# EAGLE design SWD-IR-SMD-V01-001 (EAGLE 7.6.0)
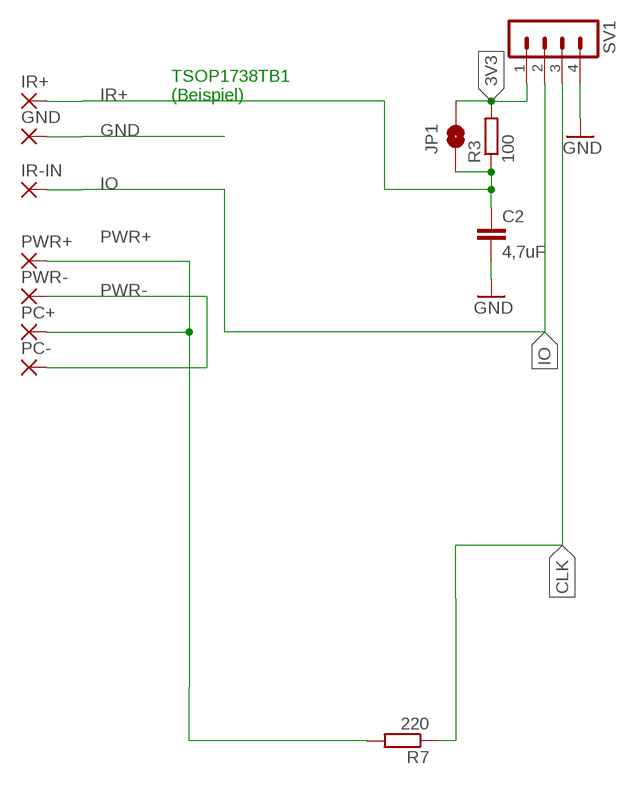
[diagram p0: schematic, sheet 1]

## Parts
C2  4,7uF  C-EUC1206K  [C1206K]
GND  SMD2  [SMD1,27-2,54]
IR+  SMD2  [SMD1,27-2,54]
IR-IN  SMD2  [SMD1,27-2,54]
JP1  JUMPER-SMT_2_NO_NO-SILK  [SMT-JUMPER_2_NO_NO-SILK]
PC+  SMD2  [SMD1,27-2,54]
PC-  SMD2  [SMD1,27-2,54]
PWR+  SMD2  [SMD1,27-2,54]
PWR-  SMD2  [SMD1,27-2,54]
R3  100  R-EU_R0805W  [R0805W]
R7  220  R-EU_R0805W  [R0805W]
SV1  MA04-1  [MA04-1]

## Nets
3V3: JP1.2 R3.2 SV1.1
CLK: R7.1 SV1.3
GND [Power]: C2.2 GND.1(P) SV1.4
IO: IR-IN.1(P) SV1.2
IR+: C2.1 IR+.1(P) JP1.1 R3.1
PWR+: PC+.1(P) PWR+.1(P) R7.2
PWR-: PC-.1(P) PWR-.1(P)

## Notes on the sheet
- TSOP1738TB1
  (Beispiel)

## Library data of the parts
C2 = rcl:C-EU: CAPACITOR, European symbol
GND IR+ IR-IN PC+ PC- PWR+ PWR- = wirepad:SMD2: SMD PAD
JP1 = SparkFun-Jumpers:JUMPER-SMT_2_NO: Normally open jumper This jumper has two pads in close proximity to each other. Apply solder to close the connection. Round pads are easier to solder for beginners, but are a lot larger. SparkFun Product that uses the round pads: SparkFun EL Sequencer <https://www.sparkfun.com/products/12781>
R3 R7 = rcl:R-EU_: RESISTOR, European symbol
SV1 = con-lstb:MA04-1: PIN HEADER; OC_FARNELL: unknown; OC_NEWARK: unknown

## Net classes
0 default: width 0.305 mm
1 Power: width 0.406 mm

## Board
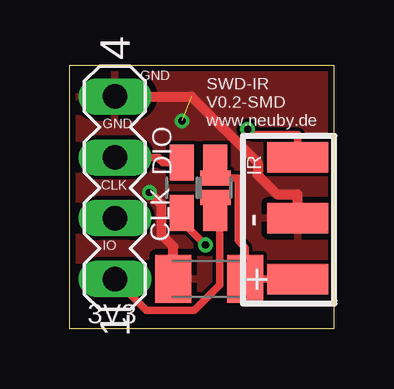
[diagram p1: board, top side]
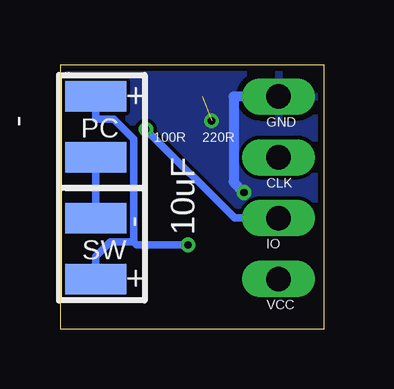
[diagram p2: board, bottom side, seen from below]

Size 11 x 11 mm. Coordinates in mm from the lower left corner, seen from the top.
Outline: 0,11 11,11 11,0 0,0 0,11
Copper layers (1*16): Top 0.035mm / dielectric 1.5mm / Bottom 0.035mm
Design rules "Fusion_eagle_rule_v1.1": minimum track width 6mil, minimum drill 12mil, track to track 6mil, track to pad 6mil, pad to pad 6mil, via to via 6mil, smd to smd 0mil, copper to edge 10mil, drill to drill 10mil, minimum pad ring 10mil, minimum via ring 6mil, stop-mask expansion 2mil, vias tented up to drill 100mil, thermal gap 10mil

### Footprints (pad centres in the part's own frame; a part is rotated, then mirrored left to right if it is on the bottom)
C1206K = smd 1.5 x 2: 1 -1.5,0; 2 1.5,0
SMD1,27-2,54 = smd 1.27 x 2.54: 1 0,0
SMT-JUMPER_2_NO_NO-SILK = smd 0.635 x 1.27: 1 -0.406,0; 2 0.406,0
R0805W = smd 1.5 x 1: 1 -1.052,0; 2 1.052,0
MA04-1 = drill 1.016 long: 1 -3.81,0; 2 -1.27,0; 3 1.27,0; 4 3.81,0

### Placement (x,y rotation side)
C2  5.83,2.08 180 top
GND  9.51,4.62 90 top
IR+  9.51,2.08 90 top
IR-IN  9.51,7.16 90 top
JP1  6.08,5.89 270 top
PC+  9.51,9.7 90 bottom
PC-  9.51,7.16 90 bottom
PWR+  9.51,2.08 90 bottom
PWR-  9.51,4.62 90 bottom
R3  6.08,5.89 270 top
R7  4.68,5.89 270 top
SV1  1.89,5.89 90 top

### Tracks (layer width: path | path; a pad name or v marks a point on that pad's centre or on a via)
3V3
  Top 0.305: SV1.1 3.2,0.77 5.2,0.77 6.27,1.84 6.27,4.65 R3.2 JP1.2
CLK
  Top 0.305: SV1.3 3.72,7.16 3.72,7.1 3.88,6.94 R7.1
GND  (via drill 0.3 pad 0.61)  (1 unrouted)
  Top 0.406: GND.1 9.51,5.61 8.65,5.61 7.84,6.43 7.84,6.94 5.08,9.7 SV1.4 | C2.2 4.33,3.44 3.83,3.93 3.83,5.2 v3.33,5.7
  Bottom 0.406: SV1.4 3.77,9.7 3.77,6.13 v3.33,5.7
  other vias: 4.68,8.68
  pour Top: 0.37,10.72 10.78,10.72 10.78,0.3 0.37,0.3
  pour Bottom: 0.37,10.72 10.78,10.72 10.78,0.3 0.37,0.3
IO  (via drill 0.3 pad 0.61)
  Top 0.305: v7.42,8.32 7.65,8.1 9.51,8.1 IR-IN.1
  Bottom 0.305: v7.42,8.32 3.72,4.62 SV1.2
IR+
  Top 0.305: IR+.1 7.94,2.08 7.94,2.12 7.33,2.73 | 7.33,2.73 7.33,3.38 7.02,3.69 7.02,6.3 JP1.1 R3.1 | C2.1 7.33,2.73
PWR+  (via drill 0.3 pad 0.61)
  Top 0.305: R7.2 4.68,4.48 v5.66,3.5
  Bottom 0.305: 7.93,3.63 7.81,3.5 v5.66,3.5 | 7.93,3.63 8.9,3.63 9.51,3.02 PWR+.1 | 7.93,3.63 7.93,7.92 8.77,8.76 9.51,8.76 PC+.1
PWR-
  Bottom 0.305: PWR-.1 PC-.1

### Text on the board
tNames: GND | SWD-IR | V0.2-SMD | GND | www.neuby.de | CLK | CLK | DIO | IR | - | IO | + | 3V3
bNames: + | GND | 220R | 100R | PC | - | CLK | 10uF | - | IO | SW | + | VCC
tValues: www.neuby.de